# Altium schematic sheet 通信接口.SchDoc
size A4; Organization: Altium Limited; Address1: L3, 12a Rodborough Rd; Address2: Frenchs Forest; Address3: NSW; Address4: Australia 2086
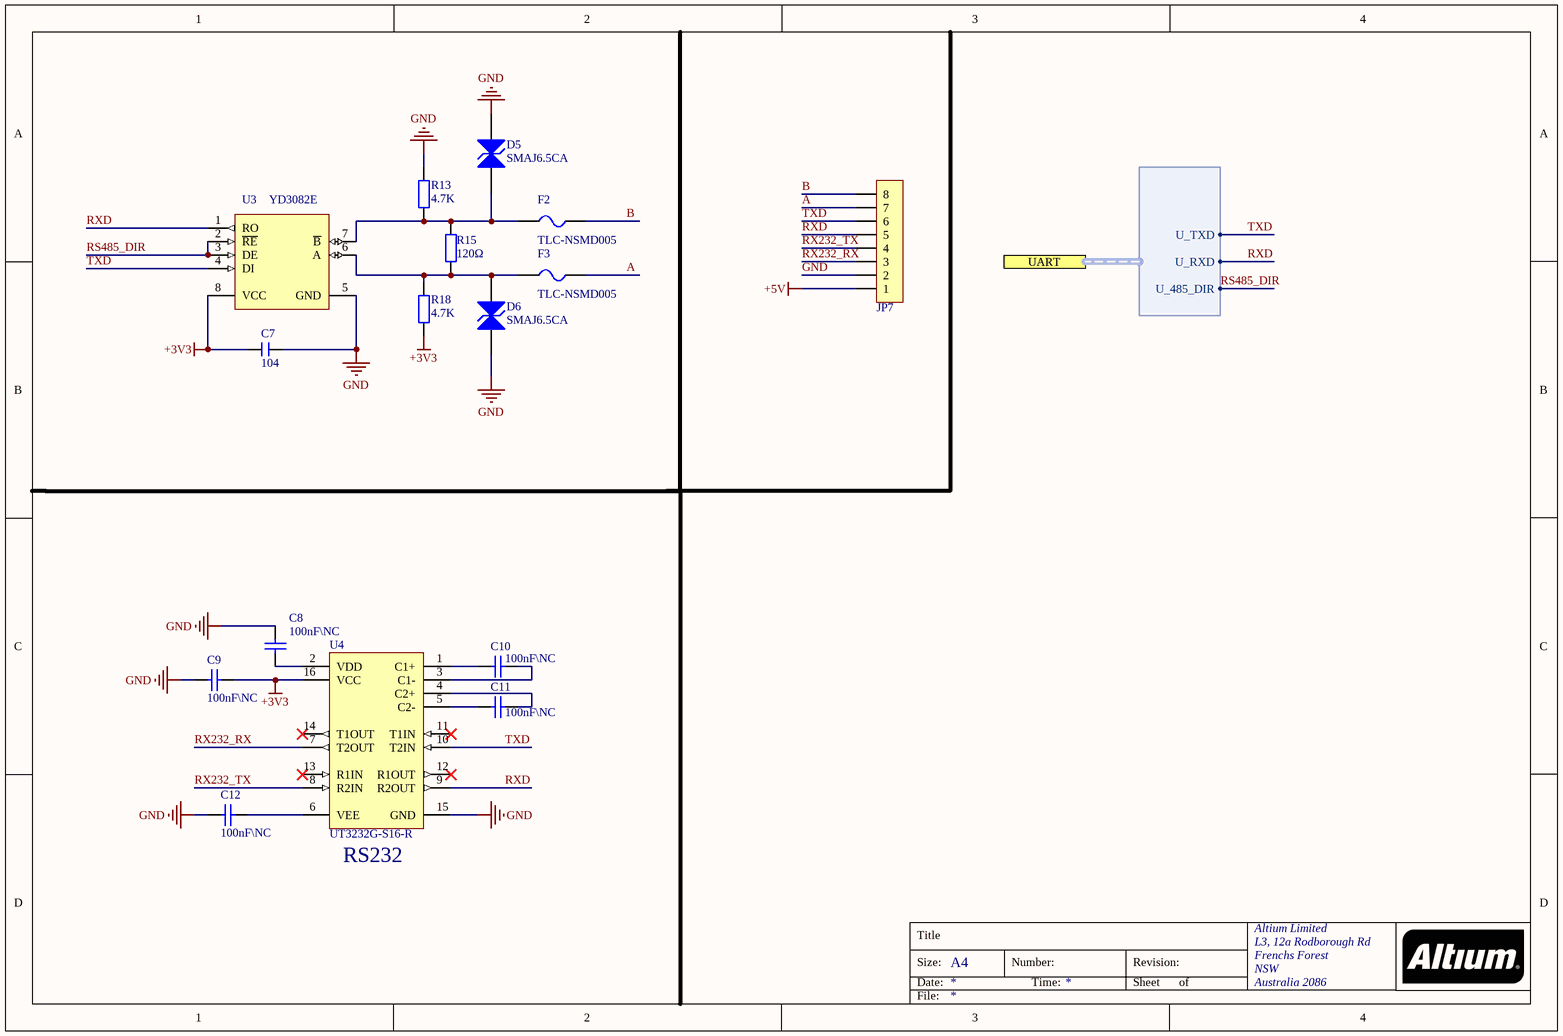
[diagram p0: 通信接口.SchDoc]

## Parts
C7  104  [C 0603]
C8  100nF\NC  [0603_C]
C9  100nF\NC  [0603_C]
C10  100nF\NC  [0603_C]
C11  100nF\NC  [0603_C]
C12  100nF\NC  [0603_C]
D5  SMAJ6.5CA  [SMA(DO-214AC)_S1]
D6  SMAJ6.5CA  [SMA(DO-214AC)_S1]
F2  TLC-NSMD005  [FU 1206]
F3  TLC-NSMD005  [FU 1206]
JP7  XH-2.54-8P  [XH2.54-8P]  (value not drawn)
R13  4.7K  [R 0603]
R15  120Ω  [0603_R]
R18  4.7K  [R 0603]
U3  YD3082E  [SOIC-8_150mil]
U4  UT3232G-S16-R  [SOIC-16_150mil]

## Ports
UART (harness USART)

## Harnesses
USART: U_TXD, U_RXD, U_485_DIR

## Nets
+3V3: C7.1 C9.2 R18.1 U3.8(VCC) U4.16(VCC)
+5V: JP7.1
GND: C7.2 C8.2 C9.1 C12.1 D5.1(A) D6.1(A) JP7.2 R13.2 U3.5(GND) U4.15(GND)
A: F3.2 JP7.7
B: F2.2 JP7.8
RS485_DIR: U3.2(~{RE}) U3.3(DE) ; port UART.U_485_DIR
RX232_RX: JP7.3 U4.7(T2OUT)
RX232_TX: JP7.4 U4.8(R2IN)
RXD: JP7.5 U3.1(RO) U4.9(R2OUT) ; port UART.U_RXD
TXD: JP7.6 U3.4(DI) U4.10(T2IN) ; port UART.U_TXD
NetC8_1: C8.1 U4.2(VDD)
NetC10_1: C10.1 U4.1(C1+)
NetC10_2: C10.2 U4.3(C1-)
NetC11_1: C11.1 U4.5(C2-)
NetC11_2: C11.2 U4.4(C2+)
NetC12_2: C12.2 U4.6(VEE)
NetD5_2: D5.2(K) F2.1 R13.1 R15.1 U3.7(~{B})
NetD6_2: D6.2(K) F3.1 R15.2 R18.2 U3.6(A)

Not connected (* = marked no-connect by the designer): U4 11(T1IN)* 12(R1OUT)* 13(R1IN)* 14(T1OUT)*

## Notes on the sheet
- (near U4) RS232
- Title
- Size:
- Date:
- A4
- Number:
- Time:
- Revision:
- Sheet
- of
- File:

## Library data of the parts
C7 = C: 无极性贴片电容; 版权归属: 源创客; BOM名称: 无极性贴片电容; 学习资源: www.ooocke.com
C8-C12 = 0603 100nF (104) 10% 50V: 贴片电容; ComponentLink1Description: 供应商链接; ComponentLink1URL: http://www.szlcsc.com/product/details_15331.html; Package: 0603; Supplier: LC; SuppliersPartNumber: C14663
D5 D6 = SMB/DO-214AA P6SMB6.8CA: TVS; ComponentLink1Description: 供应商链接; ComponentLink1URL: http://www.szlcsc.com/product/details_79530.html; Package: SMB/DO-214AA; Supplier: LC; SuppliersPartNumber: C78395
F2 F3 = FU: 贴片保险丝; 版权归属: 源创客; BOM名称: 贴片保险丝; 学习资源: www.ooocke.com
JP7 = Header 8: 8P接插件; 版权归属: 源创客; BOM名称: 8P接插件; 学习资源: www.ooocke.com
R13 R18 = R: 贴片电阻; 版权归属: 源创客; BOM名称: 贴片电阻; 学习资源: www.ooocke.com
R15 = 0603 120Ω (1200) 1%: 贴片电阻; ComponentLink1Description: 供应商链接; ComponentLink1URL: http://www.szlcsc.com/product/details_23514.html; Package: 0603; Supplier: LC; SuppliersPartNumber: C22787
U3 = SP485EEN-L/TR: RS-485/RS-422; ComponentLink1Description: 供应商链接; ComponentLink1URL: http://www.szlcsc.com/product/details_7327.html; Package: SOIC-8; Supplier: LC; SuppliersPartNumber: C6855
U4 = MAX232ESE: RS232; ComponentLink1Description: 供应商链接; ComponentLink1URL: http://www.szlcsc.com/product/details_27608.html; Package: SOIC-16_150mil; Supplier: LC; SuppliersPartNumber: C26860